# Altium schematic sheet BMS-Shem-v1.SchDoc
size 558 x 431 mm; SheetNumber: 1; SheetTotal: 1
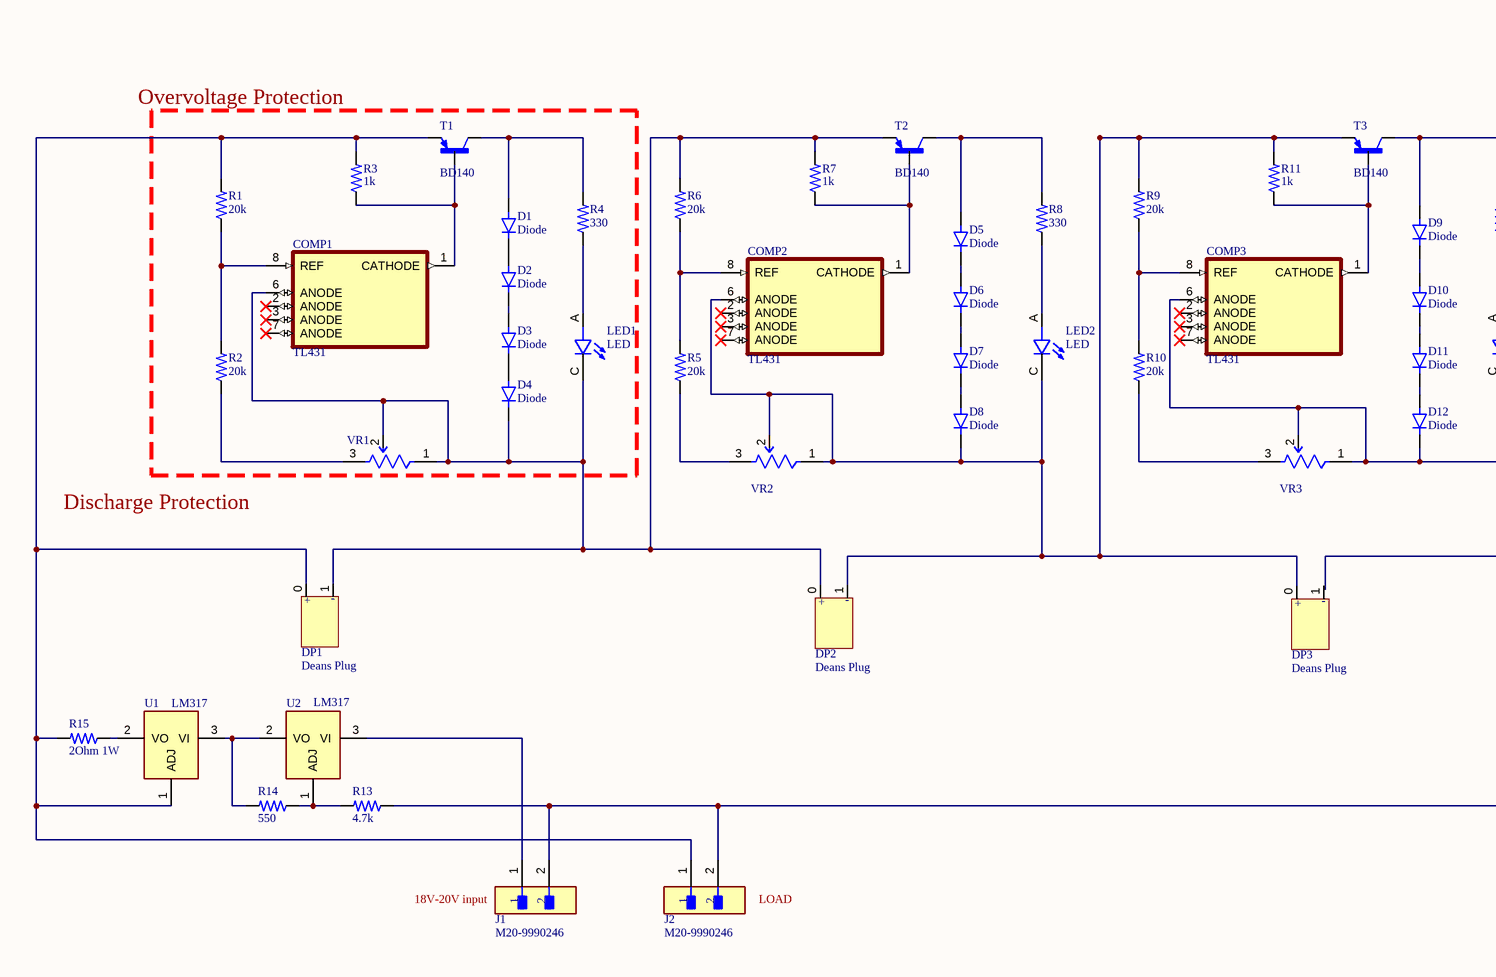
[diagram p0: BMS-Shem-v1.SchDoc, left]
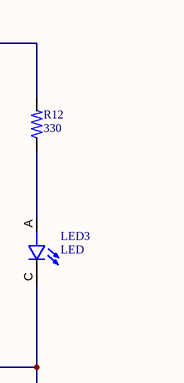
[diagram p1: BMS-Shem-v1.SchDoc, right]

## Parts
COMP1  TL431  [SOIC127P599X175-8N]
COMP2  TL431  [SOIC127P599X175-8N]
COMP3  TL431  [SOIC127P599X175-8N]
D1  Diode  [DIOAD1060W80L520D270]
D2  Diode  [DIOAD1060W80L520D270]
D3  Diode  [DIOAD1060W80L520D270]
D4  Diode  [DIOAD1060W80L520D270]
D5  Diode  [DIOAD1060W80L520D270]
D6  Diode  [DIOAD1060W80L520D270]
D7  Diode  [DIOAD1060W80L520D270]
D8  Diode  [DIOAD1060W80L520D270]
D9  Diode  [DIOAD1060W80L520D270]
D10  Diode  [DIOAD1060W80L520D270]
D11  Diode  [DIOAD1060W80L520D270]
D12  Diode  [DIOAD1060W80L520D270]
DP1  Deans Plug
DP2  Deans Plug
DP3  Deans Plug
J1  M20-9990246  [FP-M20-9990246-MFG]
J2  M20-9990246  [FP-M20-9990246-MFG]
LED1  LED  [LED_151054RS03000]
LED2  LED  [LED_151054RS03000]
LED3  LED  [LED_151054RS03000]
R1  20k  [RESC2012X65N]
R2  20k  [RESC2012X65N]
R3  1k  [RESC2012X65N]
R4  330  [RESC2012X65N]
R5  20k  [RESC2012X65N]
R6  20k  [RESC2012X65N]
R7  1k  [RESC2012X65N]
R8  330  [RESC2012X65N]
R9  20k  [RESC2012X65N]
R10  20k  [RESC2012X65N]
R11  1k  [RESC2012X65N]
R12  330  [RESC2012X65N]
R13  4.7k  [RESC2012X65N]
R14  550  [RESC2012X65N]
R15  2Ohm 1W  [RESC2012X65N]
T1  BD140  [TO245P780X300X1364-3]
T2  BD140  [TO245P780X300X1364-3]
T3  BD140  [TO245P780X300X1364-3]
U1  LM317  [TO-220]
U2  LM317  [TO-220]
VR1  Res_Bourns_3296W-1-502LF_eec  [Bourns_3296W-1-502LF_0]  (value not drawn)
VR2  Res_Bourns_3296W-1-502LF_eec  [Bourns_3296W-1-502LF_0]  (value not drawn)
VR3  Res_Bourns_3296W-1-502LF_eec  [Bourns_3296W-1-502LF_0]  (value not drawn)

## Nets
NetCOMP1_1: COMP1.1(CATHODE) R3.1 T1.3(B)
NetCOMP1_6: COMP1.6(ANODE) D4.C DP1.1 DP2.0 LED1.C R6.2 R7.2 T2.1(E) VR1.1(CCW) VR1.2(WIPER)
NetCOMP1_8: COMP1.8(REF) R1.1 R2.2
NetCOMP2_1: COMP2.1(CATHODE) R7.1 T2.3(B)
NetCOMP2_6: COMP2.6(ANODE) D8.C DP2.1 DP3.0 LED2.C R9.2 R11.2 T3.1(E) VR2.1(CCW) VR2.2(WIPER)
NetCOMP2_8: COMP2.8(REF) R5.2 R6.1
NetCOMP3_1: COMP3.1(CATHODE) R11.1 T3.3(B)
NetCOMP3_6: COMP3.6(ANODE) D12.C J1.2 J2.2 LED3.C R13.1 VR3.1(CCW) VR3.2(WIPER)
NetCOMP3_8: COMP3.8(REF) R9.1 R10.2
NetD1_A: D1.A R4.2 T1.2(C)
NetD1_C: D1.C D2.A
NetD2_C: D2.C D3.A
NetD3_C: D3.C D4.A
NetD5_A: D5.A R8.2 T2.2(C)
NetD5_C: D5.C D6.A
NetD6_C: D6.C D7.A
NetD7_C: D7.C D8.A
NetD9_A: D9.A R12.2 T3.2(C)
NetD9_C: D9.C D10.A
NetD10_C: D10.C D11.A
NetD11_C: D11.C D12.A
NetDP1_0: DP1.0 J2.1 R1.2 R3.2 R15.2 T1.1(E) U1.1(ADJ)
NetJ1_1: J1.1 U2.3(VI)
NetLED1_A: LED1.A R4.1
NetLED2_A: LED2.A R8.1
NetLED3_A: LED3.A R12.1
NetR2_1: R2.1 VR1.3(CW)
NetR5_1: R5.1 VR2.3(CW)
NetR10_1: R10.1 VR3.3(CW)
NetR13_2: R13.2 R14.1 U2.1(ADJ)
NetR14_2: R14.2 U1.3(VI) U2.2(VO)
NetR15_1: R15.1 U1.2(VO)

Not connected (* = marked no-connect by the designer): COMP1 2(ANODE)* 3(ANODE)* 7(ANODE)*; COMP2 2(ANODE)* 3(ANODE)* 7(ANODE)*; COMP3 2(ANODE)* 3(ANODE)* 7(ANODE)*; DP3 1

## Notes on the sheet
- Overvoltage Protection
- Discharge Protection
- (near J1) 18V-20V input
- (near J2) LOAD
- DWG. NO.
- REV.
- SHT.
- REVISION
- DESCRIPTION
- DATE
- APPROVED
- THIS DOCUMENT AND THE DATA DISCLOSED HEREIN OR HEREWITH IS THE PROPERTY OF ALTIUM LIMITED AND MAY BE FREELY DISTRIBUTED IN WHOLE. NO RIGHTS ARE RESERVED OR EXPRESS OR IMPLIED WARANTEE GIVEN.
- ENG:
- DSN:
- APPROVALS
- PROJECT
- DOCUMENT REVISION:
- DESIGN ITEM:
- CHK:
- BOM:
- REFERENCE DOCUMENTS
- PROJECT REVISION:
- TITLE
- FAB DWG:
- PCB DWG:
- ASSY DWG:
- SCALE:
- SIZE
- C
- CAGE CODE
- FILE NAME
- DWG NO.
- SHEET
- OF
- REV
- (in symbol Deans Plug) +; -

## Library data of the parts
COMP1-COMP3 = TL431: Adjustable precision shunt regulator 8-SOIC 0 to 70; MF: Texas Instruments; MP: TL431CD; Price: None; Value: *; Availability: Good; DigiKey-Purchase-URL: https://snapeda.com/shop?store=DigiKey&id=4775895; Mouser-Purchase-URL: https://snapeda.com/shop?store=Mouser&id=4775895; SnapEDA_Link: https://www.snapeda.com/parts/TL431CD/Texas%20Instruments/view-part/4775895/?ref=snap; Texas_Instruments-Purchase-URL: https://snapeda.com/shop?store=Texas+Instruments&id=4775895; Package: SOIC-8 Texas Instruments
D1-D12 = Diode: Diode Standard 1000V 1A Through Hole DO-204AL _DO-41_; MF: ON Semiconductor; MP: 1N4007; Package: DO-41 Good-Ark; Value: *; Price: None; Availability: Unavailable; SnapEDA_Link: https://www.snapeda.com/parts/1N4007/ON%20Semiconductor/view-part/2816213/?ref=snap
J1 J2 = CMP-15831-000009-1: CONN HEADER VERT 2POS 2.54MM; Manufacturer: Harwin; Conn Gender: Male; Conn Orientation: Vertical; Number Of Contacts: 2; Current Rating: 3A; ComponentLink2URL: https://cdn.harwin.com/pdfs/M20-999.pdf; ComponentLink2Description: Datasheet; Package: M20-9990246; Temperature: -40°C to +105°C; Octopart: https://octopart.com/m20-9990246-harwin-2590635; Mouser Description: 2.54mm (0.1") Pitch SIL Vertical PC Tail Pin Header, 6.1mm mating pin height, tin, 2 contacts; Temperature Range High: +105°C; Device Class L1: Connectors; RoHS: TRUE; Automotive: No; Height: 8.99mm; Number Of Rows: 1; Contact Material: Tin,Nickel; Category: Conn; Pitch: 2.54mm; Lead Free: Yes; Digikey Description: CONN HEADER VERT 2POS 2.54MM; Manufacturer Part Number: M20-9990246; Temperature Range Low: -40°C; Device Class L3: unset; Device Class L2: Headers and Wire Housings
LED1-LED3 = LED: Red 623nm LED Indication - Discrete 1.9V Radial; MF: Wurth Electronics; MP: 151054RS03000; Value: *; SnapEDA_Link: https://www.snapeda.com/parts/151054RS03000/Wurth%20Electronics%20Inc./view-part/609365/?ref=snap; Price: None; Availability: Unavailable; Package: Radial WÃ¼rth Elektronik
R1 R2 R5 R6 R9 R10 = Resistor: RES 20k OHM 1% 1/4W 0805; Resistance: .33; MF: TE Connectivity; Power_Rating: .25 W; MP: 2-2176053-0; Price: None; EU_RoHS_Compliance: Compliant with Exemptions; Tolerance: 1%; Value: *; Availability: Unavailable; SnapEDA_Link: https://www.snapeda.com/parts/2-2176053-0/TE%20Connectivity/view-part/2214508/?ref=snap; Package: 0805
R3 R7 R11 = Resistor: RES 1k OHM 1% 1/4W 0805; Resistance: .33; MF: TE Connectivity; Power_Rating: .25 W; MP: 2-2176053-0; Price: None; EU_RoHS_Compliance: Compliant with Exemptions; Tolerance: 1%; Value: *; Availability: Unavailable; SnapEDA_Link: https://www.snapeda.com/parts/2-2176053-0/TE%20Connectivity/view-part/2214508/?ref=snap; Package: 0805
R4 R8 R12 = Resistor: RES 330 OHM 1% 1/4W 0805; Resistance: .33; MF: TE Connectivity; Power_Rating: .25 W; MP: 2-2176053-0; Price: None; EU_RoHS_Compliance: Compliant with Exemptions; Tolerance: 1%; Value: *; Availability: Unavailable; SnapEDA_Link: https://www.snapeda.com/parts/2-2176053-0/TE%20Connectivity/view-part/2214508/?ref=snap; Package: 0805
R13 = Resistor: RES 4.7k OHM 1% 1/4W 0805; Resistance: .33; MF: TE Connectivity; Power_Rating: .25 W; MP: 2-2176053-0; Price: None; EU_RoHS_Compliance: Compliant with Exemptions; Tolerance: 1%; Value: *; Availability: Unavailable; SnapEDA_Link: https://www.snapeda.com/parts/2-2176053-0/TE%20Connectivity/view-part/2214508/?ref=snap; Package: 0805
R14 = Resistor: RES 550 OHM 1% 1/4W 0805; Resistance: .33; MF: TE Connectivity; Power_Rating: .25 W; MP: 2-2176053-0; Price: None; EU_RoHS_Compliance: Compliant with Exemptions; Tolerance: 1%; Value: *; Availability: Unavailable; SnapEDA_Link: https://www.snapeda.com/parts/2-2176053-0/TE%20Connectivity/view-part/2214508/?ref=snap; Package: 0805
R15 = Resistor: RES 2 OHM 1% 1/4W 0805; Resistance: .33; MF: TE Connectivity; Power_Rating: .25 W; MP: 2-2176053-0; Price: None; EU_RoHS_Compliance: Compliant with Exemptions; Tolerance: 1%; Value: *; Availability: Unavailable; SnapEDA_Link: https://www.snapeda.com/parts/2-2176053-0/TE%20Connectivity/view-part/2214508/?ref=snap; Package: 0805
T1-T3 = BD140: Bipolar _BJT_ Transistor PNP 80V 1.5A 1.25W Through Hole SOT-32-3; MF: STMicroelectronics; SnapEDA_Link: https://www.snapeda.com/parts/BD140/STMicroelectronics/view-part/4503197/?ref=snap; Value: *; MP: BD140; Package: TO-126 STMicroelectronics; Price: None; Availability: Unavailable
U1 U2 = LM317: Linear Voltage Regulator IC 1 Output 100mA SOT-89-3; MF: ON Semiconductor; Value: *; Price: None; Availability: Unavailable; SnapEDA_Link: https://www.snapeda.com/parts/LM317/ON%20Semiconductor/view-part/2723883/?ref=snap; Package: SOIC-8 ON Semiconductor; MP: LM317
VR1-VR3 = Res_Bourns_3296W-1-502LF_eec: RES TRIMMER 5K OHM 0.5W PC PIN; Manufacturer: Bourns; Resistance: 5kΩ; Value: 5kΩ; Temperature Coefficient: ±100ppm/°C; Tolerance: ±10%; Number of Turns: 25; Power: 500mW; Part Number: 3296W-1-502LF; helpURL: https://upverter.com/upn/revision/1712d714ad2c9eb5/; ComponentLink2Description: Datasheet; Temperature: -55°C to +125°C; Package: PTH_9MM53_4MM83; Supplier 2: Mouser; Price: 1.73531008228; Supplier 1: Digi-Key; ComponentLink1URL: https://upverter.com/upn/revision/1712d714ad2c9eb5/; Supplier Part Number 2: 652-3296W-1-502LF; Supplier Part Number 1: 3296W-502LF-ND; ComponentLink1Description: Upverter; ComponentLink2URL: http://www.bourns.com/docs/Product-Datasheets/3296.pdf; RoHS: TRUE; Mouser Part Number: 652-3296W-1-502LF; Temperature Range High: +125°C; Digikey Description: RES TRIMMER 5K OHM 0.5W PC PIN; Digikey Part Number: 3296W-502LF-ND; Lead Free: yes; Temperature Range Low: -55°C